# Altium schematic sheet Power.SchDoc
size Tabloid; DrawnBy: V-P.Rheaume@USherbrooke.ca; Organization: Universite de Sherbrooke; Address1: L3, 12a Rodborough Rd; Address2: Frenchs Forest; Address3: NSW; Address4: Australia 2086; Revision: 0; SheetNumber: 2; SheetTotal: 8; SheetName: Battery management
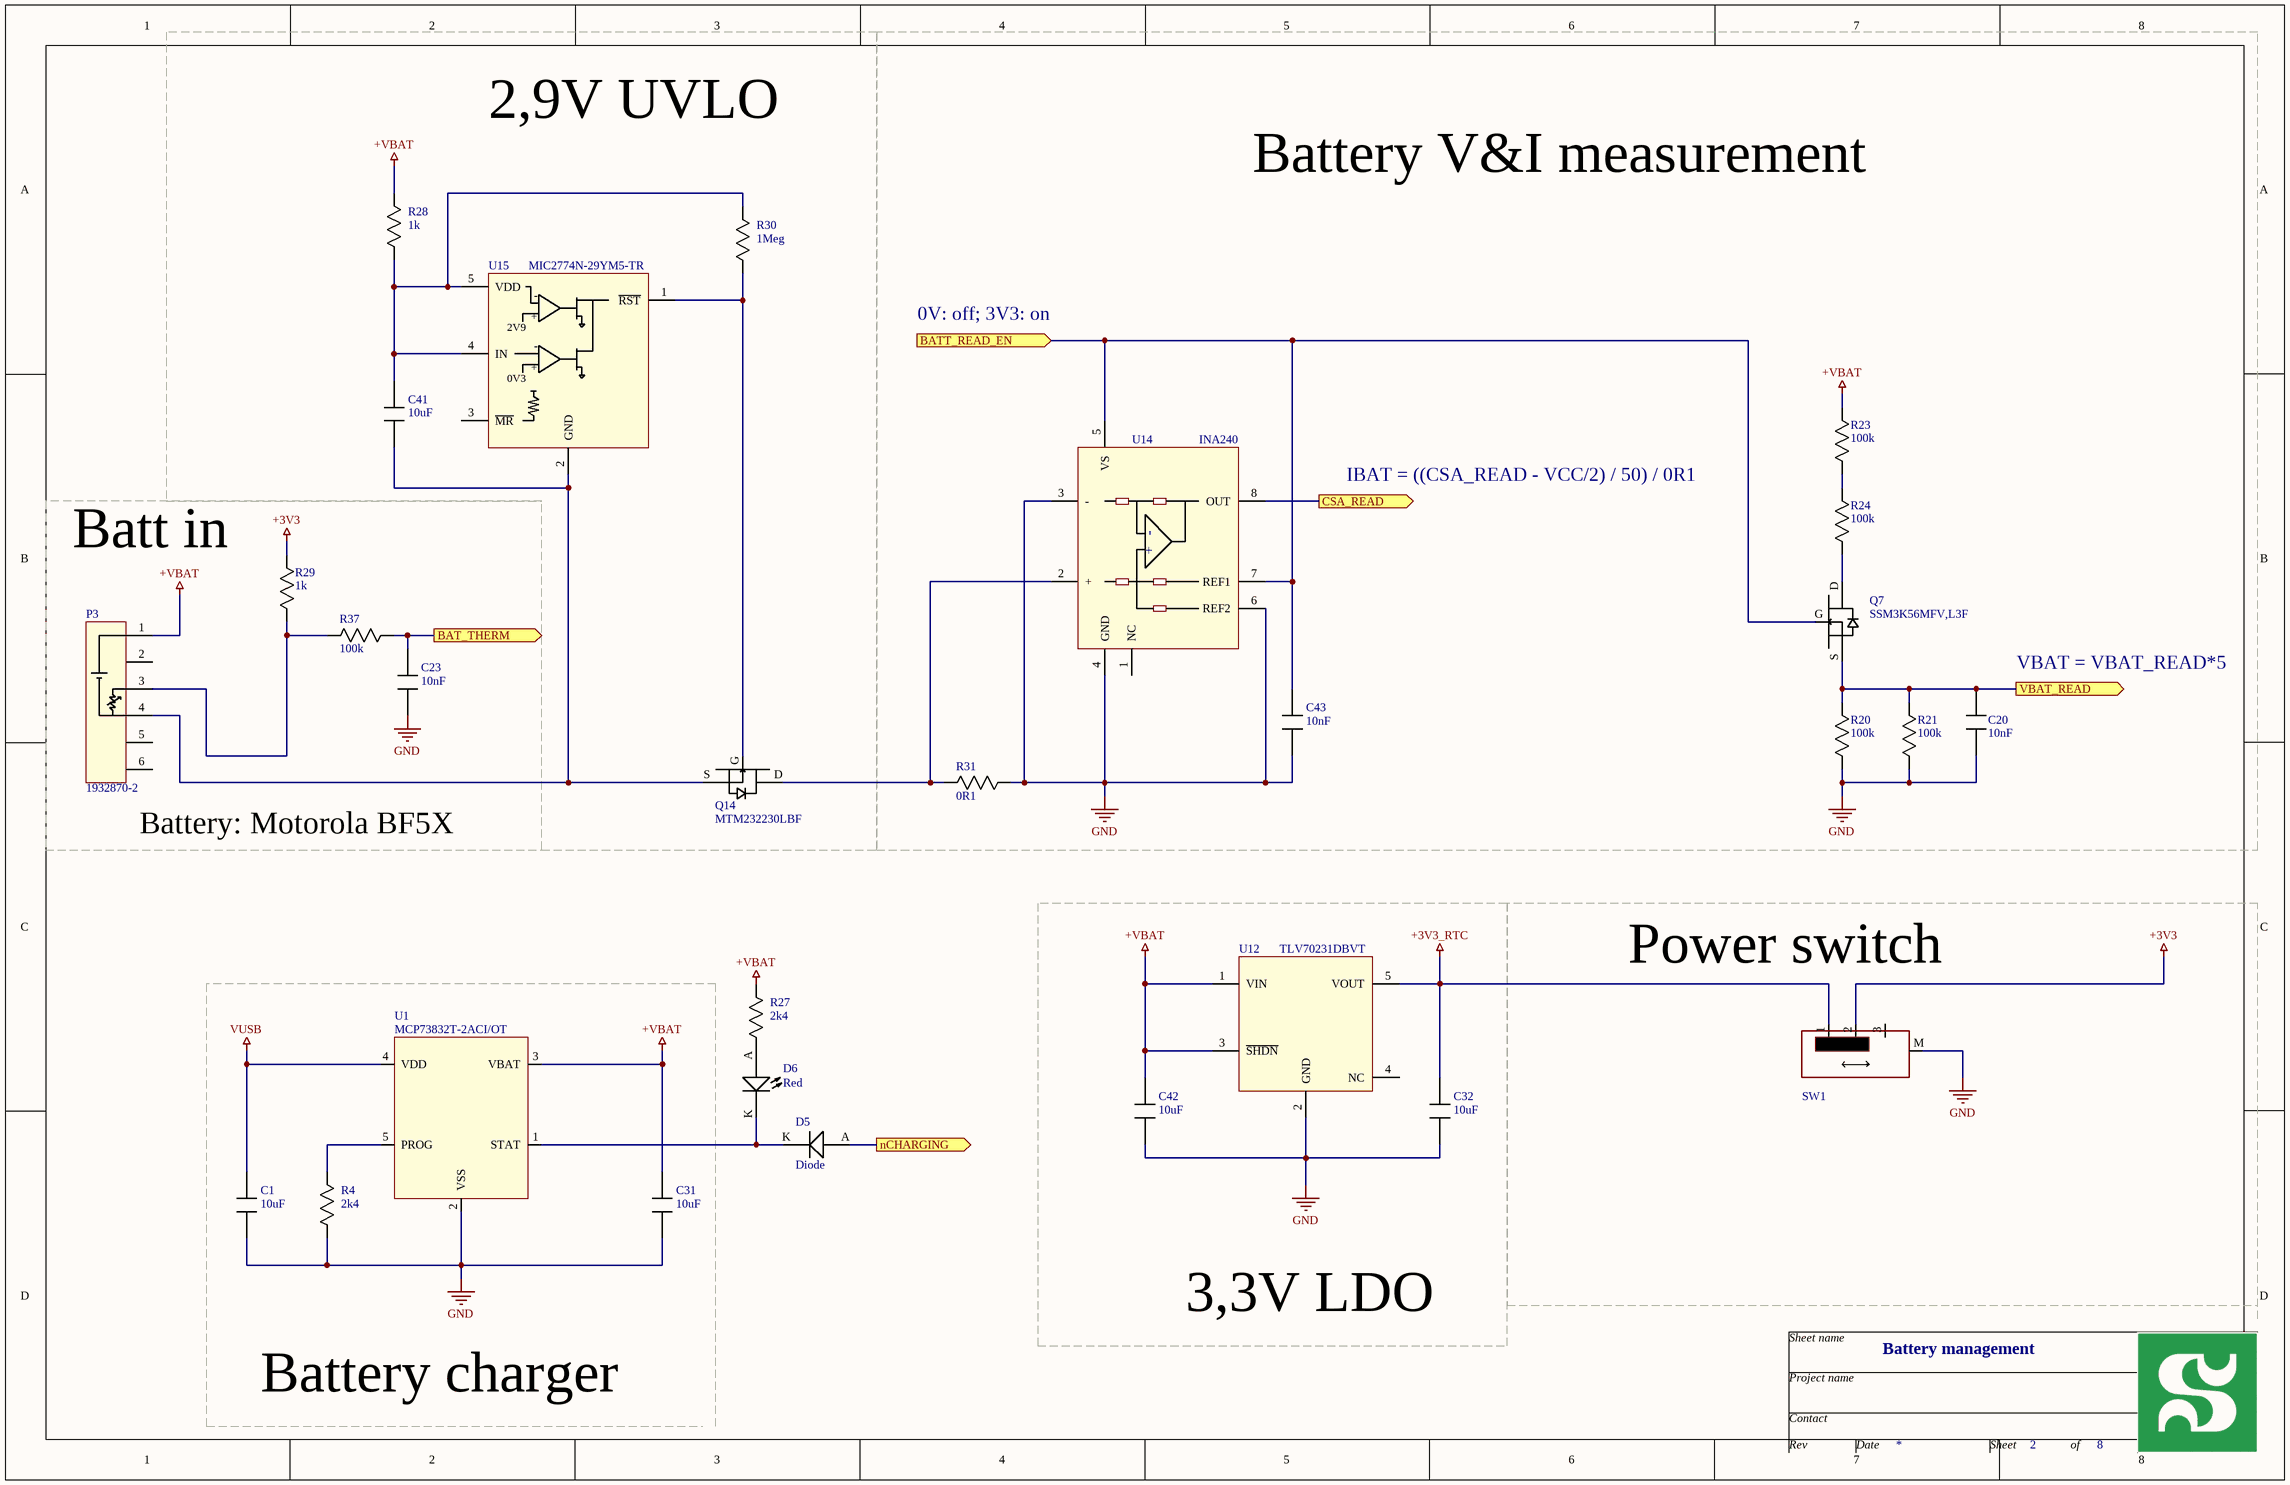
[diagram p0: Power.SchDoc]

## Parts
C1  value 10uF  [0603]  (hidden comment: Capacitor)
C20  value 10nF  [0603]  (hidden comment: Capacitor)
C23  value 10nF  [0603]  (hidden comment: Capacitor)
C31  value 10uF  [0603]  (hidden comment: Capacitor)
C32  value 10uF  [0603]  (hidden comment: Capacitor)
C41  value 10uF  [0603]  (hidden comment: Capacitor)
C42  value 10uF  [0603]  (hidden comment: Capacitor)
C43  value 10nF  [0603]  (hidden comment: Capacitor)
D5  Diode  [DIODE_SOD523]
D6  value Red  [0805_LED]  (hidden comment: Diode_LED)
P3  Mfg_PN: 1932870-2  [CONN6_FBIS2_V]  (hidden comment: CON6_FBIS2)
Q7  Mfg_PN: SSM3K56MFV,L3F  [SOT723]  (hidden comment: MOSFET_N_GDS)
Q14  Mfg_PN: MTM232230LBF  [SC70_GDS]  (hidden comment: MOSFET_N_GDS)
R4  value 2k4  [0402]  (hidden comment: Resistor)
R20  value 100k  [0402]  (hidden comment: Resistor)
R21  value 100k  [0402]  (hidden comment: Resistor)
R23  value 100k  [0402]  (hidden comment: Resistor)
R24  value 100k  [0402]  (hidden comment: Resistor)
R27  value 2k4  [0402]  (hidden comment: Resistor)
R28  value 1k  [0603]  (hidden comment: Resistor)
R29  value 1k  [0402]  (hidden comment: Resistor)
R30  value 1Meg  [0603]  (hidden comment: Resistor)
R31  value 0R1  [0603]  (hidden comment: Resistor)
R37  value 100k  [0402]  (hidden comment: Resistor)
SW1  Button_Slideswitch_MLL1200S  [SWITCH_ MLL1200S]  (value not drawn)
U1  Mfg_PN: MCP73832T-2ACI/OT  [SOT23_5]  (hidden comment: MCP73831T-2ACI/OT)
U12  Mfg_PN: TLV70231DBVT  [SOT23_5]  (hidden comment: AP2112K-3.3TRG1)
U14  INA240  [TSSOP8]
U15  MIC2774N-29YM5-TR  [SOT23_5]

## Blocks framed on the sheet
Battery V&I measurement: C20 C43 Q7 R20 R21 R23 R24 R31 U14
Batt in: C23 P3 R29 R37
3,3V LDO: C32 C42 U12

## Ports
BAT_THERM (out), BATT_READ_EN (in), CSA_READ (out), nCHARGING (out), VBAT_READ (out)

## Nets
+3V3: R29.2 SW1.2
+3V3_RTC: C32.2 SW1.1 U12.5(VOUT)
+VBAT: C31.2 C42.2 P3.1 R23.2 R27.1 R28.1 U1.3(VBAT) U12.1(VIN) U12.3(~{SHDN})
GND: C1.1 C20.1 C23.1 C31.1 C32.1 C42.1 C43.1 R4.2 R20.1 R21.1 R31.2 SW1.M U1.2(VSS) U12.2(GND) U14.3(-) U14.4(GND) U14.6(REF2)
VUSB: C1.2 U1.4(VDD)
BAT_THERM: C23.2 R37.1 ; port BAT_THERM
BATT_READ_EN: C43.2 Q7.G U14.5(VS) U14.7(REF1) ; port BATT_READ_EN
CSA_READ: U14.8(OUT) ; port CSA_READ
nCHARGING: D5.A ; port nCHARGING
VBAT_READ: C20.2 Q7.S R20.2 R21.2 ; port VBAT_READ
NetC41_1: C41.1 P3.4(-) Q14.S U15.2(GND)
NetC41_2: C41.2 R28.2 R30.1 U15.4(IN) U15.5(VDD)
NetD5_K: D5.K D6.K U1.1(STAT)
NetD6_A: D6.A R27.2
NetP3_3: P3.3 R29.1 R37.2
NetQ7_D: Q7.D R24.1
NetQ14_D: Q14.D R31.1 U14.2(+)
NetQ14_G: Q14.G R30.2 U15.1(~{RST})
NetR4_1: R4.1 U1.5(PROG)
NetR23_1: R23.1 R24.2

Not connected (* = marked no-connect by the designer): P3 2 5 6; SW1 3; U12 4(NC); U14 1(NC); U15 3(~{MR})

## Notes on the sheet
- 2,9V UVLO
- 0V: off; 3V3: on
- IBAT = ((CSA_READ - VCC/2) / 50) / 0R1
- VBAT = VBAT_READ*5
- (near P3) Battery: Motorola BF5X
- Power switch
- Battery charger
- Sheet name
- Project name
- Contact
- Rev
- Date
- Sheet
- of
- (in symbol MIC2774N-29YM5-TR) -; +; 2V9; 0V3

## Library data of the parts
C1 C31 C32 C41 C42 = Capacitor: Mfg: Murata; Mfg_PN: GRM188R60J106ME47D; HelpURL: *; NI: *; Supplier1: Digikey; Supplier1_PN: 490-3896-1-ND; Tolerance: *; Type: *; Rating: *
C20 C23 C43 = Capacitor: Mfg: Wurth; Mfg_PN: 885012206040; HelpURL: *; NI: *; Supplier1: Digikey; Supplier1_PN: 732-7959-1-ND; Tolerance: *; Type: *; Rating: *
D5 = Diode: Mfg: MCC; Mfg_PN: 1N4148X-TP; HelpURL: *; NI: *; Supplier1: Digikey; Supplier1_PN: 1N4148XTPMSCT-ND; Tolerance: *; Type: *; Rating: *; Value: *
D6 = Diode_LED: LED; Mfg: Wurth; Mfg_PN: 150080RS75000; HelpURL: *; NI: *; Supplier1: Digikey; Supplier1_PN: 732-4984-1-ND; Tolerance: *; Type: *; Rating: *
P3 = CON6_FBIS2: 6-pins for Motorola?; Mfg: TE; HelpURL: *; NI: *; Rating: *; Supplier1: Digikey; Supplier1_PN: A117909CT-ND; Tolerance: *; Type: *; Value: *
Q7 = MOSFET_N_GDS: NMOS; Mfg: Toshiba; HelpURL: *; NI: *; Rating: *; Supplier1: Digikey; Supplier1_PN: SSM3K56MFVL3FCT-ND; Tolerance: *; Type: *; Value: *
Q14 = MOSFET_N_GDS: NMOS; Mfg: Panasonic; HelpURL: *; NI: *; Rating: *; Supplier1: Digikey; Supplier1_PN: MTM232230LBFCT-ND; Tolerance: *; Type: *; Value: *
R4 R27 = Resistor: Mfg: Yageo; Mfg_PN: RC0402JR-072K4L; HelpURL: *; NI: *; Supplier1: Digikey; Supplier1_PN: 311-2.4KJRCT-ND; Type: *; Rating: *; Tolerance: *
R20 R21 R23 R24 R37 = Resistor: Mfg: Yageo; Mfg_PN: RC0402JR-07100KL; HelpURL: *; NI: *; Supplier1: Digikey; Supplier1_PN: 311-100KJRCT-ND; Type: *; Rating: *; Tolerance: *
R28 = Resistor: Mfg: Yageo; Mfg_PN: RC0603JR-071KL; HelpURL: *; NI: *; Supplier1: Digikey; Supplier1_PN: 311-1.0KGRCT-ND; Type: *; Rating: *; Tolerance: *
R29 = Resistor: Mfg: TE; Mfg_PN: CRG0402J1K0; HelpURL: *; NI: *; Supplier1: Digikey; Supplier1_PN: A106129CT-ND; Type: *; Rating: *; Tolerance: *
R30 = Resistor: Mfg: Stackpole; Mfg_PN: RMCF0603JG1M00; HelpURL: *; NI: *; Supplier1: Digikey; Supplier1_PN: RMCF0603JG1M00CT-ND; Type: *; Rating: *; Tolerance: *
R31 = Resistor: Mfg: TE; Mfg_PN: RL73N1JR10JTD; HelpURL: *; NI: *; Supplier1: Digikey; Supplier1_PN: A103277CT-ND; Type: *; Rating: *; Tolerance: *
SW1 = Button_Slideswitch_MLL1200S: Slide switch; Mfg: TE; HelpURL: *; Mfg_PN: MLL1200S; NI: *; Rating: *; Tolerance: *; Value: *; Supplier1: Digikey; Supplier1_PN: 450-1577-ND
U1 = MCP73831T-2ACI/OT: Lithium Ion Battery charger, linear; Mfg: Microchip; HelpURL: *; NI: *; Supplier1: Digikey; Supplier1_PN: MCP73832T-2ACI/OTCT-ND; Type: *
U12 = AP2112K-3.3TRG1: Linear voltage regulator; Mfg: TI; HelpURL: *; NI: *; Supplier1: Digikey; Supplier1_PN: 296-27894-1-ND; Type: *
U14 = INA240: High/low-side bidirectional current sense with enhanced PWM rejection; fixed-gain, 20, 50, 100 or 200; Mfg: Texas Instruments; Mfg_PN: INA240A2PW; HelpURL: *; NI: *; Rating: *; Supplier1: Digikey; Supplier1_PN: 296-47187-ND; Tolerance: *; Value: *
U15 = MIC2774N-29YM5-TR: Voltage supervisor and power-on timer, dual; Mfg: Micrel; HelpURL: *; Mfg_PN: MIC2774N-29YM5-TR; NI: *; Rating: *; Supplier1: Digikey; Supplier1_PN: 576-1101-1-ND; Tolerance: *; Type: *; Value: *